# EAGLE design headstage (EAGLE 6.5.0)
HEADSTAGE_TYPE: JMD Dual RHD2132; REVISION: 0.0
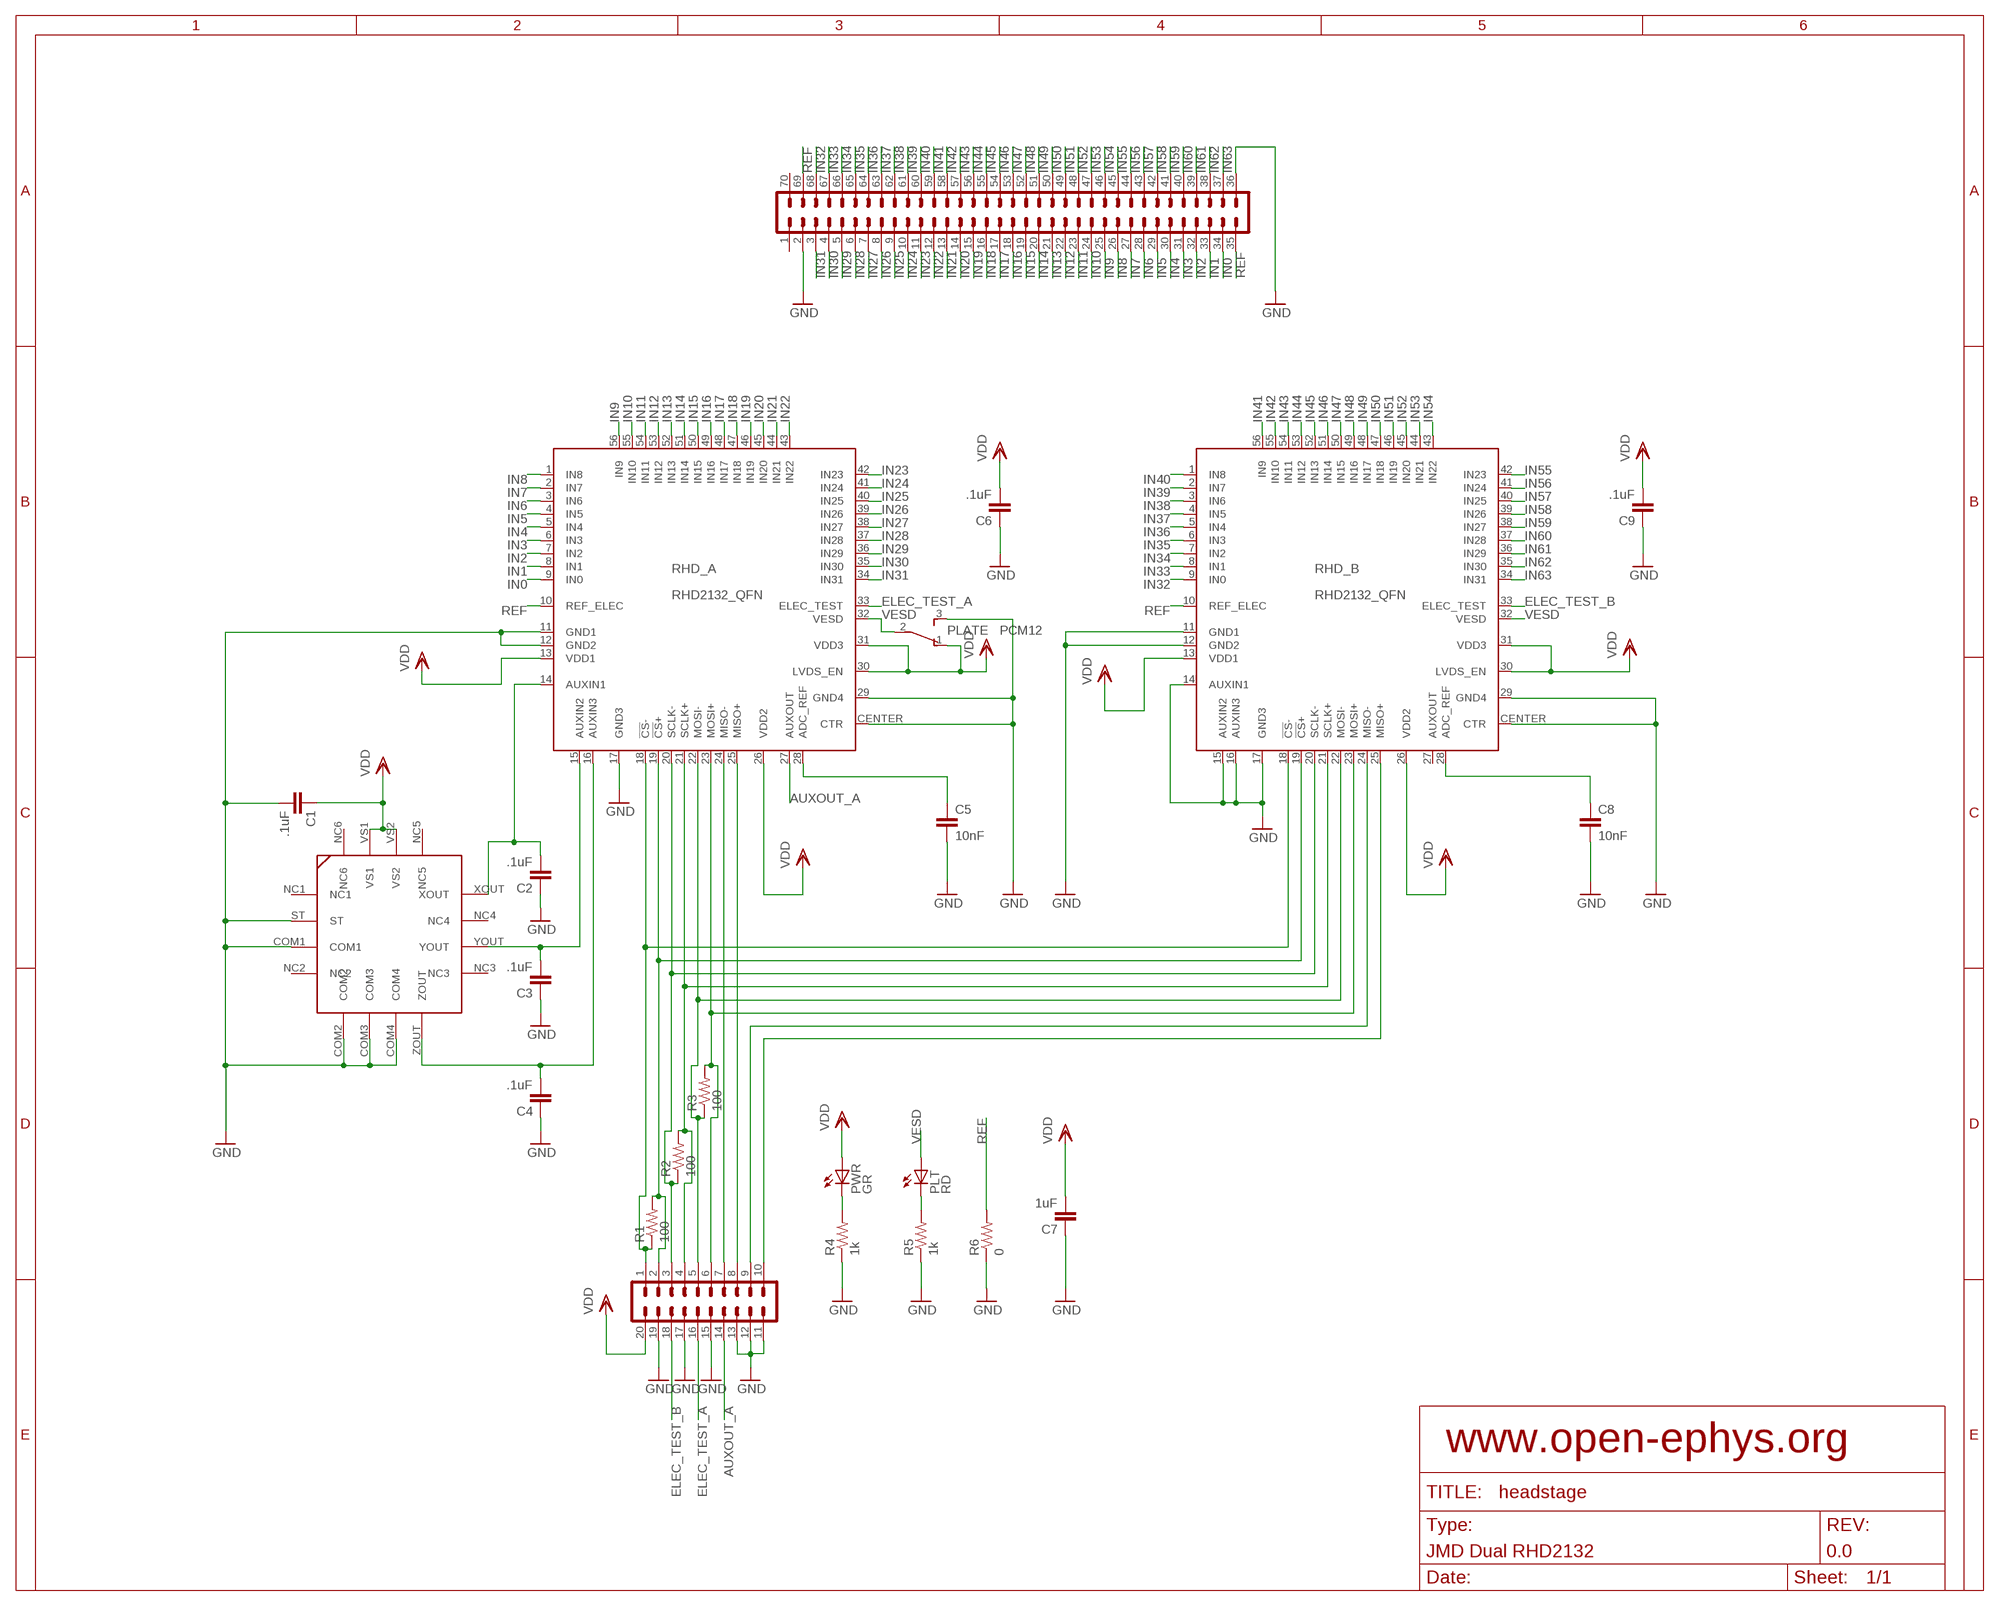
[diagram p0: schematic, sheet 1]

## Parts
AIN  JMD70  PINHD-2X35_JMD70  [JMD70]
C1  .1uF  C_0402  [0402]
C2  .1uF  C_0402  [0402]
C3  .1uF  C_0402  [0402]
C4  .1uF  C_0402  [0402]
C5  10nF  C_0402  [0402]
C6  .1uF  C_0603  [0603]
C7  1uF  C_0603  [0603]
C8  10nF  C_0402  [0402]
C9  .1uF  C_0603  [0603]
OUT  JMD  PINHD-2X10_JMD-RA  [JMD20-RA]
PLATE  PCM12  SPDT_PCM12  [PCM12]
PLT  RD  LED_0603  [CHIP-LED0603]
PWR  GR  LED_0603  [CHIP-LED0603]
R1  100  R_0402  [0402]
R2  100  R_0402  [0402]
R3  100  R_0402  [0402]
R4  1k  R_0402  [0402]
R5  1k  R_0402  [0402]
R6  0  R_0402  [0402]
RHD_A  RHD2132_QFN  [QFN56_8_X_8_LARGE]
RHD_B  RHD2132_QFN  [QFN56_8_X_8_LARGE]
U1  ADXL335  [ADXL335]

## Nets
AUXOUT_A: OUT.14 RHD_A.27(AUXOUT)
CS+: OUT.2 R1.2 RHD_A.19(!CS!+) RHD_B.19(!CS!+)
CS-: OUT.1 R1.1 RHD_A.18(!CS!-) RHD_B.18(!CS!-)
ELEC_TEST_A: OUT.16 RHD_A.33(ELEC_TEST)
ELEC_TEST_B: OUT.18 RHD_B.33(ELEC_TEST)
GND: AIN.2 AIN.36 C1.2 C2.1 C3.1 C4.1 C5.2 C6.1 C7.1 C8.2 C9.1 OUT.11 OUT.12 OUT.13 OUT.15 OUT.17 OUT.19 PLATE.3 R4.1 R5.1 R6.1 RHD_A.11(GND1) RHD_A.12(GND2) RHD_A.17(GND3) RHD_A.29(GND4) RHD_A.CENTER(CTR) RHD_B.11(GND1) RHD_B.12(GND2) RHD_B.14(AUXIN1) RHD_B.15(AUXIN2) RHD_B.16(AUXIN3) RHD_B.17(GND3) RHD_B.29(GND4) RHD_B.CENTER(CTR) U1.COM1 U1.COM2 U1.COM3 U1.COM4 U1.ST
IN0: AIN.34 RHD_A.9(IN0)
IN1: AIN.33 RHD_A.8(IN1)
IN2: AIN.32 RHD_A.7(IN2)
IN3: AIN.31 RHD_A.6(IN3)
IN4: AIN.30 RHD_A.5(IN4)
IN5: AIN.29 RHD_A.4(IN5)
IN6: AIN.28 RHD_A.3(IN6)
IN7: AIN.27 RHD_A.2(IN7)
IN8: AIN.26 RHD_A.1(IN8)
IN9: AIN.25 RHD_A.56(IN9)
IN10: AIN.24 RHD_A.55(IN10)
IN11: AIN.23 RHD_A.54(IN11)
IN12: AIN.22 RHD_A.53(IN12)
IN13: AIN.21 RHD_A.52(IN13)
IN14: AIN.20 RHD_A.51(IN14)
IN15: AIN.19 RHD_A.50(IN15)
IN16: AIN.18 RHD_A.49(IN16)
IN17: AIN.17 RHD_A.48(IN17)
IN18: AIN.16 RHD_A.47(IN18)
IN19: AIN.15 RHD_A.46(IN19)
IN20: AIN.14 RHD_A.45(IN20)
IN21: AIN.13 RHD_A.44(IN21)
IN22: AIN.12 RHD_A.43(IN22)
IN23: AIN.11 RHD_A.42(IN23)
IN24: AIN.10 RHD_A.41(IN24)
IN25: AIN.9 RHD_A.40(IN25)
IN26: AIN.8 RHD_A.39(IN26)
IN27: AIN.7 RHD_A.38(IN27)
IN28: AIN.6 RHD_A.37(IN28)
IN29: AIN.5 RHD_A.36(IN29)
IN30: AIN.4 RHD_A.35(IN30)
IN31: AIN.3 RHD_A.34(IN31)
IN32: AIN.68 RHD_B.9(IN0)
IN33: AIN.67 RHD_B.8(IN1)
IN34: AIN.66 RHD_B.7(IN2)
IN35: AIN.65 RHD_B.6(IN3)
IN36: AIN.64 RHD_B.5(IN4)
IN37: AIN.63 RHD_B.4(IN5)
IN38: AIN.62 RHD_B.3(IN6)
IN39: AIN.61 RHD_B.2(IN7)
IN40: AIN.60 RHD_B.1(IN8)
IN41: AIN.59 RHD_B.56(IN9)
IN42: AIN.58 RHD_B.55(IN10)
IN43: AIN.57 RHD_B.54(IN11)
IN44: AIN.56 RHD_B.53(IN12)
IN45: AIN.55 RHD_B.52(IN13)
IN46: AIN.54 RHD_B.51(IN14)
IN47: AIN.53 RHD_B.50(IN15)
IN48: AIN.52 RHD_B.49(IN16)
IN49: AIN.51 RHD_B.48(IN17)
IN50: AIN.50 RHD_B.47(IN18)
IN51: AIN.49 RHD_B.46(IN19)
IN52: AIN.48 RHD_B.45(IN20)
IN53: AIN.47 RHD_B.44(IN21)
IN54: AIN.46 RHD_B.43(IN22)
IN55: AIN.45 RHD_B.42(IN23)
IN56: AIN.44 RHD_B.41(IN24)
IN57: AIN.43 RHD_B.40(IN25)
IN58: AIN.42 RHD_B.39(IN26)
IN59: AIN.41 RHD_B.38(IN27)
IN60: AIN.40 RHD_B.37(IN28)
IN61: AIN.39 RHD_B.36(IN29)
IN62: AIN.38 RHD_B.35(IN30)
IN63: AIN.37 RHD_B.34(IN31)
LEDOUT1: PWR.C R4.2
LEDOUT2: PLT.C R5.2
MIS02-: OUT.9 RHD_B.24(MISO-)
MISO1+: OUT.8 RHD_A.25(MISO+)
MISO1-: OUT.7 RHD_A.24(MISO-)
MISO2+: OUT.10 RHD_B.25(MISO+)
MOSI+: OUT.6 R3.2 RHD_A.23(MOSI+) RHD_B.23(MOSI+)
MOSI-: OUT.5 R3.1 RHD_A.22(MOSI-) RHD_B.22(MOSI-)
N$3: C8.1 RHD_B.28(ADC_REF)
N$7: C5.1 RHD_A.28(ADC_REF)
REF: AIN.35 AIN.69 R6.2 RHD_A.10(REF_ELEC) RHD_B.10(REF_ELEC)
SCLK+: OUT.4 R2.2 RHD_A.21(SCLK+) RHD_B.21(SCLK+)
SCLK-: OUT.3 R2.1 RHD_A.20(SCLK-) RHD_B.20(SCLK-)
VDD: C1.1 C6.2 C7.2 C9.2 OUT.20 PLATE.1 PWR.A RHD_A.13(VDD1) RHD_A.26(VDD2) RHD_A.30(LVDS_EN) RHD_A.31(VDD3) RHD_B.13(VDD1) RHD_B.26(VDD2) RHD_B.30(LVDS_EN) RHD_B.31(VDD3) U1.VS1 U1.VS2
VESD: PLATE.2 PLT.A RHD_A.32(VESD) RHD_B.32(VESD)
XOUT1: C2.2 RHD_A.14(AUXIN1) U1.XOUT
YOUT1: C3.2 RHD_A.15(AUXIN2) U1.YOUT
ZOUT1: C4.2 RHD_A.16(AUXIN3) U1.ZOUT
Unconnected: AIN.1 AIN.70 RHD_B.27(AUXOUT) U1.NC1 U1.NC2 U1.NC3 U1.NC4 U1.NC5 U1.NC6

## Library data of the parts
AIN = headstage:PINHD-2X35
C1-C9 = headstage:C: Capacitor
OUT = headstage:PINHD-2X10
PLATE = headstage:SPDT: SPDT Switch
PLT PWR = puggleboard:LED
R1-R6 = headstage:R: Resistor
RHD_A RHD_B = headstage:RHD2132
U1 = headstage:ADXL335: The ADXL335 is a small, thin, low power, complete 3-axis accelerometer with signal conditioned voltage outputs. The product measures acceleration with a minimum full-scale range of ±3 g. It can measure the static acceleration of gravity in tilt-sensing applications, as well as dynamic acceleration resulting from motion, shock, or vibration. The user selects the bandwidth of the accelerometer using the CX, CY, and CZ capacitors at the XOUT, YOUT, and ZOUT pins. Bandwidths can be selected to suit the application, with a range of 0.5 Hz to 1600 Hz for the X and Y axes, and a range of 0.5 Hz to 550 Hz for the Z axi

## Board
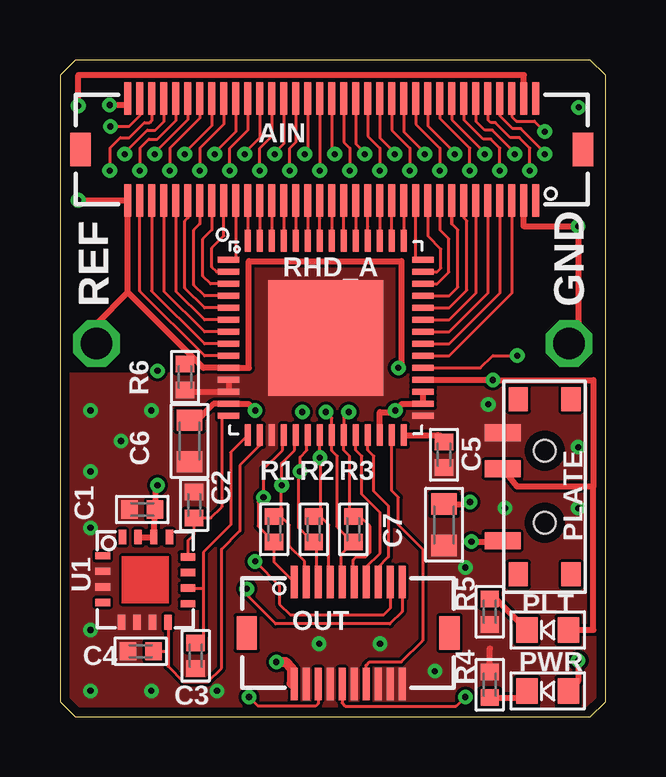
[diagram p1: board, top side]
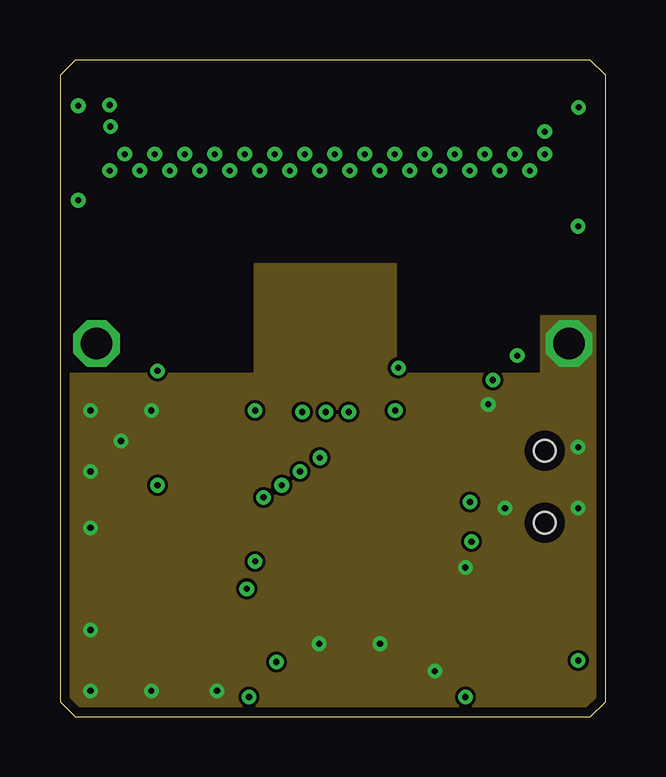
[diagram p2: board, inner layer Route2]
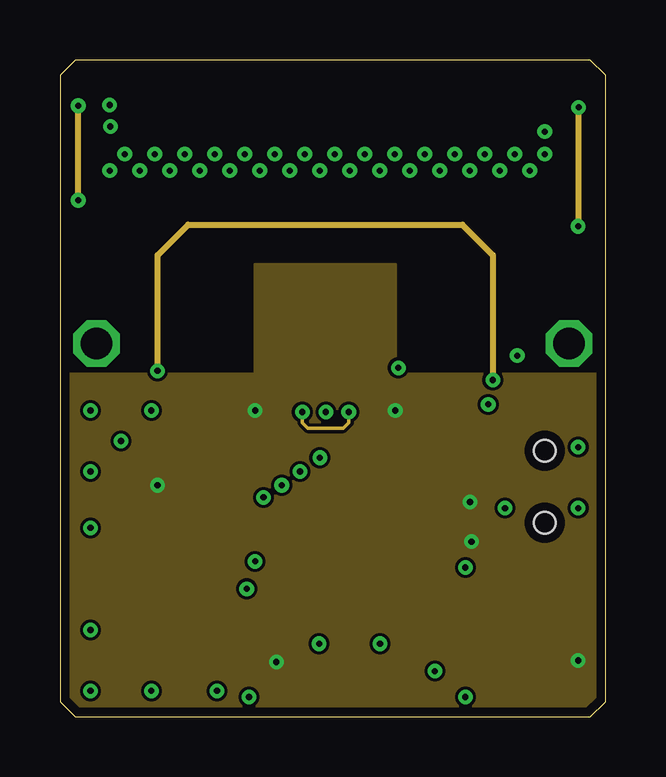
[diagram p3: board, inner layer Route15]
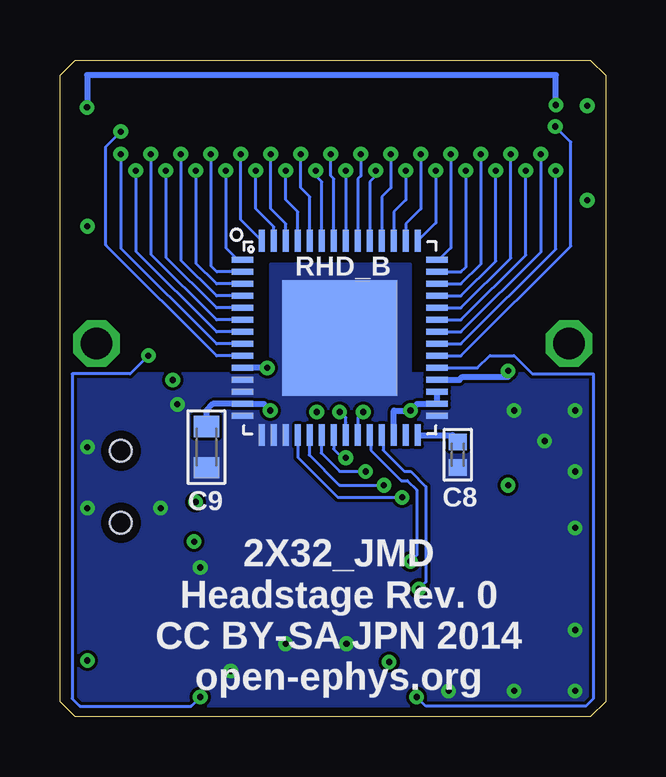
[diagram p4: board, bottom side, seen from below]

Size 22.73 x 27.37 mm. Coordinates in mm from the lower left corner, seen from the top.
Outline: 0.64,0 22.1,0 22.73,0.64 22.73,26.73 22.1,27.37 0.64,27.37 0,26.73 0,0.64 0.64,0
Copper layers (1+2*15+16): Top 0.0356mm / dielectric 1.5011mm / Route2 0.0356mm / dielectric 0.1499mm / Route15 0.0356mm / dielectric 0.2007mm / Bottom 0.0356mm
Design rules "ohs-park-4-layer": minimum track width 5mil, minimum drill 10mil, track to track 5mil, track to pad 5mil, pad to pad 5mil, via to via 5mil, smd to smd 5mil, copper to edge 15mil, drill to drill 5mil, minimum pad ring 7mil, minimum via ring 7mil, stop-mask expansion 4mil, vias tented up to drill 100mil, thermal gap 10mil

### Footprints (pad centres in the part's own frame; a part is rotated, then mirrored left to right if it is on the bottom)
JMD70 = smd 0.3 x 1.35: 1 -8.805,2.125; 2 -8.305,2.125; 3 -7.805,2.125; 4 -7.305,2.125; 5 -6.805,2.125; 6 -6.305,2.125; 7 -5.805,2.125; 8 -5.305,2.125; 9 -4.805,2.125; 10 -4.305,2.125; 11 -3.805,2.125; 12 -3.305,2.125; 13 -2.805,2.125; 14 -2.305,2.125; 15 -1.805,2.125; 16 -1.305,2.125; 17 -0.805,2.125; 18 -0.305,2.125; 19 0.195,2.125; 20 0.695,2.125; 21 1.195,2.125; 22 1.695,2.125; 23 2.195,2.125; 24 2.695,2.125; 25 3.195,2.125; 26 3.695,2.125; 27 4.195,2.125; 28 4.695,2.125; 29 5.195,2.125; 30 5.695,2.125; 31 6.195,2.125; 32 6.695,2.125; 33 7.195,2.125; 34 7.695,2.125; 35 8.195,2.125; 36 8.195,-2.125; 37 7.695,-2.125; 38 7.195,-2.125; 39 6.695,-2.125; 40 6.195,-2.125; 41 5.695,-2.125; 42 5.195,-2.125; 43 4.695,-2.125; 44 4.195,-2.125; 45 3.695,-2.125; 46 3.195,-2.125; 47 2.695,-2.125; 48 2.195,-2.125; 49 1.695,-2.125; 50 1.195,-2.125; 51 0.695,-2.125; 52 0.195,-2.125; 53 -0.305,-2.125; 54 -0.805,-2.125; 55 -1.305,-2.125; 56 -1.805,-2.125; 57 -2.305,-2.125; 58 -2.805,-2.125; 59 -3.305,-2.125; 60 -3.805,-2.125; 61 -4.305,-2.125; 62 -4.805,-2.125; 63 -5.305,-2.125; 64 -5.805,-2.125; 65 -6.305,-2.125; 66 -6.805,-2.125; 67 -7.305,-2.125; 68 -7.805,-2.125; 69 -8.305,-2.125; 70 -8.805,-2.125 | smd 0.85 x 1.4: MECH1 -10.78,0; MECH2 10.17,0
0402 = smd 0.686 x 0.762: 1 -0.533,0; 2 0.533,0
0603 = smd 0.889 x 1.067: 1 -0.864,0; 2 0.864,0
JMD20-RA = smd 0.3 x 1.35: 1 -4.5,2.125; 2 -4,2.125; 3 -3.5,2.125; 4 -3,2.125; 5 -2.5,2.125; 6 -2,2.125; 7 -1.5,2.125; 8 -1,2.125; 9 -0.5,2.125; 10 0,2.125; 11 0,-2.125; 12 -0.5,-2.125; 13 -1,-2.125; 14 -1.5,-2.125; 15 -2,-2.125; 16 -2.5,-2.125; 17 -3,-2.125; 18 -3.5,-2.125; 19 -4,-2.125; 20 -4.5,-2.125 | smd 0.85 x 1.4: MECH1 -6.475,0; MECH2 1.975,0
PCM12 = smd 0.7 x 1.5: 1 -2.25,1.75; 2 0.75,1.75; 3 2.25,1.75 | smd 1 x 0.8: NC1 -3.65,1.1; NC2 -3.65,-1.1; NC3 3.65,-1.1; NC4 3.65,1.1 | hole 0.9: 1.5,0; -1.5,0
CHIP-LED0603 = smd 1.067 x 0.889: A 0,-0.864; C 0,0.864
QFN56_8_X_8_LARGE = smd 0.9 x 0.25: 1 -4.05,3.25; 2 -4.05,2.75; 3 -4.05,2.25; 4 -4.05,1.75; 5 -4.05,1.25; 6 -4.05,0.75; 7 -4.05,0.25; 8 -4.05,-0.25; 9 -4.05,-0.75; 10 -4.05,-1.25; 11 -4.05,-1.75; 12 -4.05,-2.25; 13 -4.05,-2.75; 14 -4.05,-3.25; 29 4.05,-3.25; 30 4.05,-2.75; 31 4.05,-2.25; 32 4.05,-1.75; 33 4.05,-1.25; 34 4.05,-0.75; 35 4.05,-0.25; 36 4.05,0.25; 37 4.05,0.75; 38 4.05,1.25; 39 4.05,1.75; 40 4.05,2.25; 41 4.05,2.75; 42 4.05,3.25 | smd 0.25 x 0.9: 15 -3.25,-4.05; 16 -2.75,-4.05; 17 -2.25,-4.05; 18 -1.75,-4.05; 19 -1.25,-4.05; 20 -0.75,-4.05; 21 -0.25,-4.05; 22 0.25,-4.05; 23 0.75,-4.05; 24 1.25,-4.05; 25 1.75,-4.05; 26 2.25,-4.05; 27 2.75,-4.05; 28 3.25,-4.05; 43 3.25,4.05; 44 2.75,4.05; 45 2.25,4.05; 46 1.75,4.05; 47 1.25,4.05; 48 0.75,4.05; 49 0.25,4.05; 50 -0.25,4.05; 51 -0.75,4.05; 52 -1.25,4.05; 53 -1.75,4.05; 54 -2.25,4.05; 55 -2.75,4.05; 56 -3.25,4.05 | smd 4.8 x 4.8: CENTER 0,0
ADXL335 = smd 0.61 x 0.305: COM1 -1.775,-0.3; NC1 -1.775,1; NC2 -1.775,-0.95; NC3 1.775,-1; NC4 1.775,0.3; ST -1.775,0.35; XOUT 1.775,0.95; YOUT 1.775,-0.35 | smd 0.305 x 0.61: COM2 -1,-1.775; COM3 -0.35,-1.775; COM4 0.3,-1.775; NC5 1,1.775; NC6 -0.95,1.775; VS1 0.35,1.775; VS2 -0.3,1.775; ZOUT 0.95,-1.775

### Placement (x,y rotation side)
AIN  11.02,23.64 180 top
C1  3.43,8.64 180 top
C2  5.59,8.83 270 top
C3  5.65,2.54 90 top
C4  3.37,2.73 0 top
C5  16,10.92 270 top
C6  5.4,11.49 90 top
C7  16,8 90 top
C8  6.16,10.92 270 bottom
C9  16.64,11.24 90 bottom
OUT  14.26,3.49 0 top
PLATE  20.19,9.59 90 top
PLT  20.32,3.62 90 top
PWR  20.32,1.08 90 top
R1  8.92,7.81 90 top
R2  10.57,7.81 90 top
R3  12.22,7.81 90 top
R4  17.91,1.33 270 top
R5  17.91,4.38 90 top
R6  5.21,14.16 90 top
RHD_A  11.07,15.79 0 top
RHD_B  11.07,15.79 0 bottom
U1  3.56,5.71 0 top

### Tracks (layer width: path | path; a pad name or v marks a point on that pad's centre or on a via)
AUXOUT_A
  Top 0.127: RHD_A.27 13.82,9.42 14.1,9.14 14.1,8 15.11,6.99 15.11,3.17 14.22,2.29 12.89,2.29 12.76,2.15 OUT.14
  Top 0.152: RHD_A.27 13.84,11.72
CS+  (via drill 0.25)
  Top 0.127: 10.19,5.55 10.19,6.48 9.56,7.11 9.56,8 9.21,8.34 9.21,9.63 v9.24,9.65 9.24,10.57 9.78,11.11 9.78,11.74
  Top 0.152: OUT.2 10.19,5.55 | 9.21,8.34 R1.2 | 9.78,11.74 RHD_A.19
  Bottom 0.127: 12.36,11.7 12.36,10.91 11.09,9.65 v9.24,9.65
  Bottom 0.152: RHD_B.19 12.36,11.7
CS-  (via drill 0.25)
  Top 0.127: OUT.1 8.92,6.45 R1.1 8.26,7.94 8.26,8.95 8.45,9.14 v8.48,9.14 8.48,10.32 9.27,11.11 9.27,11.74 RHD_A.18
  Bottom 0.127: RHD_B.18 12.82,10.81 11.16,9.14 v8.48,9.14
ELEC_TEST_A  (via drill 0.25)
  Top 0.127: RHD_A.33 17.52,14.54 18.03,15.05 v19.05,15.05 | v16.89,0.83 16.51,0.45 11.89,0.45 11.76,0.58 OUT.16
  Bottom 0.127: v19.05,15.05 19.81,14.29 22.23,14.29 22.23,0.76 21.91,0.45 17.27,0.45 v16.89,0.83
ELEC_TEST_B  (via drill 0.25)
  Top 0.127: v7.87,0.83 8.26,0.45 10.65,0.45 10.76,0.55 OUT.18
  Bottom 0.127: RHD_B.33 5.34,14.54 4.83,15.05 3.81,15.05 3.05,14.29 0.51,14.29 0.51,0.76 0.83,0.45 7.49,0.45 v7.87,0.83
GND  (via drill 0.25, 1.3)
  Top 0.254: AIN.36 2.83,25.49 v2.07,25.49 | AIN.2 19.32,20.44 v21.59,20.44 | v21.59,20.44 21.61,20.44 | 5.05,13.53 R6.1 5.3,13.54 RHD_A.12 RHD_A.11 | v21.59,20.44 21.59,15.94 v21.21,15.56 | R4.1 17.91,2.86
  Route15 0.254: v21.61,25.39 21.59,25.38 v21.59,20.44
  Bottom 0.254: v2.07,25.49 2.07,26.74 21.61,26.74 v21.61,25.39
  other vias: 1.27,10.22 1.27,12.76 1.27,3.62 1.27,7.87 6.54,1.08 3.81,1.08 1.27,1.08 21.59,8.7 21.59,11.24 15.62,1.91 3.81,12.76 18.54,8.7 16.89,6.22 13.34,3.05 10.79,3.05 2.54,11.49 17.84,13.02
  pour Route2 (no thermals): 0,0 0,14.29 8.13,14.29 8.13,18.86 13.97,18.86 13.97,14.29 20.07,14.29 20.07,16.7 22.73,16.7 22.73,0
  pour Top (no thermals): 0,0 0,14.29 8.13,14.29 8.13,18.86 13.97,18.86 13.97,14.29 22.73,14.29 22.73,0
  pour Bottom (no thermals): 0,0 0,14.29 8.13,14.29 8.13,18.86 13.97,18.86 13.97,14.29 22.73,14.29 22.73,0
IN0
  Top 0.127: RHD_A.9 6.03,15.04 3.33,17.74 AIN.34
  Top 0.152: AIN.34
IN1
  Top 0.127: RHD_A.8 6.03,15.54 3.83,17.74 | AIN.33 3.83,17.78 | 3.83,17.78 3.83,17.74 | 3.83,17.74 3.83,17.78 | 3.83,17.78
IN2
  Top 0.127: RHD_A.7 6.03,16.04 4.33,17.74 | AIN.32 4.33,17.74 | 4.33,17.74
IN3
  Top 0.127: RHD_A.6 6.03,16.54 4.83,17.74 | AIN.31 4.83,17.74 | 4.83,17.74
IN4
  Top 0.127: 5.33,20.79 5.2,20.66 5.2,17.86 6.03,17.04 RHD_A.5 | AIN.30 5.33,20.83 | 5.33,20.83 5.33,20.79 | 5.33,20.79 5.33,20.83 | 5.33,20.83
IN5
  Top 0.127: 5.83,20.54 5.58,20.29 5.58,17.99 6.03,17.54 RHD_A.4 | AIN.29 5.83,20.57 | 5.83,20.57 5.83,20.54 | 5.83,20.54 5.83,20.57 | 5.83,20.57
IN6
  Top 0.127: 6.33,20.29 | 6.33,20.29 5.95,19.91 5.95,18.36 6.28,18.04 RHD_A.3 | AIN.28 6.33,20.29
IN7
  Top 0.127: RHD_A.2 6.53,18.54 6.33,18.74 6.33,19.54 6.83,20.04 AIN.27
  Top 0.152: AIN.27
IN8
  Top 0.127: AIN.26 7.33,19.04
  Top 0.152: 7.33,19.04 RHD_A.1 7.33,19.04
IN9
  Top 0.127: AIN.25 RHD_A.56
  Top 0.152: RHD_A.56
IN10
  Top 0.127: AIN.24 RHD_A.55
  Top 0.152: RHD_A.55
IN11
  Top 0.127: AIN.23 RHD_A.54
  Top 0.152: RHD_A.54
IN12
  Top 0.127: AIN.22 RHD_A.53
  Top 0.152: RHD_A.53
IN13
  Top 0.127: AIN.21 RHD_A.52
  Top 0.152: RHD_A.52
IN14
  Top 0.127: AIN.20 RHD_A.51
  Top 0.152: RHD_A.51
IN15
  Top 0.127: RHD_A.50 10.82,20.75 AIN.19
IN16
  Top 0.127: AIN.18 RHD_A.49
  Top 0.152: RHD_A.49
IN17
  Top 0.127: RHD_A.48 AIN.17
  Top 0.152: AIN.17
IN18
  Top 0.127: AIN.16 RHD_A.47
  Top 0.152: RHD_A.47
IN19
  Top 0.127: RHD_A.46 12.82,20.44 AIN.15
IN20
  Top 0.127: AIN.14 RHD_A.45
  Top 0.152: RHD_A.45
IN21
  Top 0.127: RHD_A.44 AIN.13
  Top 0.152: AIN.13
IN22
  Top 0.127: AIN.12 RHD_A.43
  Top 0.152: RHD_A.43
IN23
  Top 0.127: 14.82,19.04 AIN.11
  Top 0.152: 14.82,19.04 RHD_A.42 | AIN.11
IN24
  Top 0.127: RHD_A.41 15.71,18.54 15.87,18.7 15.87,19.49 15.32,20.04 AIN.10
  Top 0.152: AIN.10
IN25
  Top 0.127: RHD_A.40 15.71,18.04 16.2,18.53 16.2,19.91 15.82,20.29 AIN.9
  Top 0.152: AIN.9
IN26
  Top 0.127: 16.32,20.54 16.57,20.29 16.57,17.9 16.21,17.54 RHD_A.39
  Top 0.152: AIN.8 | AIN.8 16.32,20.54
IN27
  Top 0.127: RHD_A.38 16.21,17.04 16.95,17.78 16.95,20.66 16.82,20.79 AIN.7
  Top 0.152: AIN.7
IN28
  Top 0.127: RHD_A.37 16.21,16.54 17.32,17.65 AIN.6
  Top 0.152: AIN.6
IN29
  Top 0.127: RHD_A.36 16.21,16.04 17.82,17.65 AIN.5
  Top 0.152: AIN.5
IN30
  Top 0.127: RHD_A.35 16.21,15.54 18.32,17.65 AIN.4
  Top 0.152: AIN.4
IN31
  Top 0.127: RHD_A.34 16.21,15.04 18.82,17.65 AIN.3
  Top 0.152: AIN.3
IN32  (via drill 0.25)
  Top 0.127: v20.2,24.38 19.76,24.82 19.01,24.82 18.82,25.01 AIN.68
  Bottom 0.127: v20.2,24.38 20.82,23.76 20.82,19.65 16.21,15.04 RHD_B.9
IN33  (via drill 0.25)
  Top 0.127: v20.2,23.45 20.2,23.51 19.2,24.51 18.86,24.51 18.32,25.05 AIN.67
  Bottom 0.127: v20.2,23.45 20.2,19.53 16.21,15.54 RHD_B.8
IN34  (via drill 0.25)
  Top 0.127: v19.57,22.76 19.57,23.7 19.14,24.13 18.76,24.13 18.14,24.76 17.95,24.76 17.82,24.89 AIN.66
  Bottom 0.127: v19.57,22.76 19.57,19.4 16.21,16.04 RHD_B.7
IN35  (via drill 0.25)
  Top 0.127: v18.95,23.45 18.95,23.51 18.01,24.45 17.7,24.45 17.32,24.82 AIN.65
  Bottom 0.127: v18.95,23.45 18.95,19.28 16.21,16.54 RHD_B.6
IN36  (via drill 0.25)
  Top 0.127: v18.32,22.76 18.32,23.7 17.95,24.07 17.64,24.07 16.82,24.89 AIN.64
  Bottom 0.127: v18.32,22.76 18.32,19.15 16.21,17.04 RHD_B.5
IN37  (via drill 0.25)
  Top 0.127: v17.7,23.45 17.7,23.51 16.32,24.89 AIN.63
  Bottom 0.127: v17.7,23.45 17.7,19.03 16.21,17.54 RHD_B.4
IN38  (via drill 0.25)
  Top 0.127: v17.07,22.76 17.07,23.7 15.82,24.95 AIN.62
  Bottom 0.127: v17.07,22.76 17.07,18.9 16.21,18.04 RHD_B.3
IN39  (via drill 0.25)
  Top 0.127: v16.45,23.45 16.45,23.51 15.32,24.64 AIN.61
  Bottom 0.127: v16.45,23.45 16.45,18.79 16.2,18.54 RHD_B.2
IN40  (via drill 0.25)
  Top 0.127: v15.82,22.76 15.82,23.7 14.82,24.7 AIN.60
  Bottom 0.127: v15.82,22.76 15.82,19.54 15.32,19.04 RHD_B.1
IN41  (via drill 0.25)
  Top 0.127: v15.2,23.45 15.2,23.51 14.32,24.39 AIN.59
  Bottom 0.127: RHD_B.56 15.2,20.71 v15.2,23.45
IN42  (via drill 0.25)
  Top 0.127: v14.57,22.76 14.57,23.7 13.82,24.45 AIN.58
  Bottom 0.127: RHD_B.55 13.82,20.41 14.57,21.16 v14.57,22.76
IN43  (via drill 0.25)
  Top 0.127: v13.95,23.45 13.95,23.51 13.32,24.14 AIN.57
  Bottom 0.127: RHD_B.54 13.32,20.54 13.95,21.16 v13.95,23.45
IN44  (via drill 0.25)
  Top 0.127: v13.32,22.76 13.32,23.7 12.82,24.2 AIN.56
  Bottom 0.127: RHD_B.53 12.82,21.04 13.32,21.54 v13.32,22.76
IN45  (via drill 0.25)
  Top 0.127: v12.7,23.45 12.7,23.51 12.32,23.89 AIN.55
  Bottom 0.127: RHD_B.52 12.32,21.66 12.7,22.04 v12.7,23.45
IN46  (via drill 0.25)
  Top 0.127: v12.07,22.76 12.07,23.7 11.82,23.95 AIN.54
  Bottom 0.127: RHD_B.51 11.82,22.29 12.07,22.54 v12.07,22.76
IN47  (via drill 0.25)
  Top 0.127: AIN.53 11.32,23.57 v11.45,23.45
  Bottom 0.127: RHD_B.50 11.32,22.41 11.45,22.54 v11.45,23.45
IN48  (via drill 0.25)
  Top 0.127: AIN.52 v10.82,22.76
  Bottom 0.127: v10.82,22.76 RHD_B.49
IN49  (via drill 0.25)
  Top 0.127: AIN.51 10.32,23.57 v10.2,23.45
  Bottom 0.127: v10.2,23.45 10.2,22.54 10.32,22.41 RHD_B.48
IN50  (via drill 0.25)
  Top 0.127: v9.57,22.76 9.57,23.7 9.82,23.95 AIN.50
  Top 0.152: AIN.50
  Bottom 0.127: v9.57,22.76 9.57,22.54 9.82,22.29 RHD_B.47
IN51  (via drill 0.25)
  Top 0.127: v8.95,23.45 8.95,23.51 9.32,23.88 AIN.49
  Top 0.152: AIN.49
  Bottom 0.127: v8.95,23.45 8.95,22.04 9.32,21.66 RHD_B.46
IN52  (via drill 0.25)
  Top 0.127: v8.32,22.76 8.32,23.7 8.82,24.2 AIN.48
  Top 0.152: AIN.48
  Bottom 0.127: v8.32,22.76 8.32,21.54 8.82,21.04 RHD_B.45
IN53  (via drill 0.25)
  Top 0.127: v7.7,23.45 7.7,23.51 8.32,24.13 AIN.47
  Top 0.152: AIN.47
  Bottom 0.127: v7.7,23.45 7.7,21.16 8.32,20.54 RHD_B.44
IN54  (via drill 0.25)
  Top 0.127: v7.08,22.76 7.08,23.7 7.83,24.45 AIN.46
  Top 0.152: AIN.46
  Bottom 0.127: v7.08,22.76 7.08,20.59 RHD_B.43
IN55  (via drill 0.25)
  Top 0.127: v6.45,23.45 6.45,23.51 7.33,24.38 AIN.45
  Top 0.152: AIN.45
  Bottom 0.127: v6.45,23.45 6.45,19.54 6.95,19.04 RHD_B.42
IN56  (via drill 0.25)
  Top 0.127: v5.83,22.76 5.83,23.7 6.83,24.7 AIN.44
  Top 0.152: AIN.44
  Bottom 0.127: v5.83,22.76 5.83,18.74 6.03,18.54 RHD_B.41
IN57  (via drill 0.25)
  Top 0.127: v5.2,23.45 5.2,23.51 6.33,24.63 AIN.43
  Top 0.152: AIN.43
  Bottom 0.127: v5.2,23.45 5.2,18.86 6.03,18.04 RHD_B.40
IN58  (via drill 0.25)
  Top 0.127: v4.58,22.76 4.58,23.7 5.83,24.95 AIN.42
  Top 0.152: AIN.42
  Bottom 0.127: RHD_B.39 6.03,17.54 4.58,18.99 v4.58,22.76
IN59  (via drill 0.25)
  Top 0.127: v3.95,23.45 3.95,23.51 5.33,24.88 AIN.41
  Top 0.152: AIN.41
  Bottom 0.127: RHD_B.38 6.03,17.04 3.95,19.11 v3.95,23.45
IN60  (via drill 0.25)
  Top 0.127: v3.33,22.76 3.33,23.7 3.7,24.07 4.05,24.07 4.83,24.84 AIN.40
  Top 0.152: AIN.40
  Bottom 0.127: RHD_B.37 6.03,16.54 3.33,19.24 v3.33,22.76
IN61  (via drill 0.25)
  Top 0.127: v2.7,23.45 2.7,23.51 3.64,24.45 3.97,24.45 4.33,24.8 AIN.39
  Top 0.152: AIN.39
  Bottom 0.127: v2.7,23.45 2.7,19.36 6.03,16.04 RHD_B.36
IN62  (via drill 0.25)
  Top 0.127: v2.08,22.76 2.08,23.7 2.51,24.13 2.89,24.13 3.51,24.76 3.74,24.76 3.83,24.85 AIN.38
  Top 0.152: AIN.38
  Bottom 0.127: RHD_B.35 6.03,15.54 2.08,19.49 v2.08,22.76
IN63  (via drill 0.25)
  Top 0.127: AIN.37 3.32,25.04 2.87,24.6 v2.1,24.6
  Top 0.152: AIN.37
  Bottom 0.127: RHD_B.34 6.03,15.04 1.45,19.61 1.45,23.95 v2.1,24.6
LEDOUT1
  Top 0.254: R4.2 19.18,0.8 PWR.C
LEDOUT2
  Top 0.254: R5.2 18.16,4.92 PLT.C
MIS02-  (via drill 0.25)
  Top 0.127: OUT.9 13.76,4.52 13.49,4.25 9.59,4.25 9.14,4.7 9.14,5.46 v8.13,6.48
  Bottom 0.127: 9.78,11.69 9.78,11.11 8.51,9.84 8.26,9.84 7.87,9.46 7.87,6.73 v8.13,6.48
  Bottom 0.152: RHD_B.24 9.78,11.69
MISO1+
  Top 0.127: OUT.8 13.26,6.24 13.68,6.67 13.68,8.79 13.08,9.4 13.08,10.86 12.82,11.11 RHD_A.25
  Top 0.152: RHD_A.25
MISO1-
  Top 0.127: OUT.7 12.76,6.25 13.34,6.83 13.34,8.51 12.57,9.27 12.57,10.86 12.32,11.11 RHD_A.24
  Top 0.152: 12.32,11.73 RHD_A.24
MISO2+  (via drill 0.25)
  Top 0.127: OUT.10 14.26,4.38 13.75,3.87 8.98,3.87 7.78,5.08 v7.78,5.33
  Bottom 0.127: 9.27,11.68 9.27,11.11 8.38,10.22 8.13,10.22 7.49,9.59 7.49,5.62 v7.78,5.33
  Bottom 0.152: RHD_B.25 9.27,11.68
MOSI+  (via drill 0.25)
  Top 0.127: 12.22,5.52 12.22,6.54 12.35,6.67 12.73,6.67 12.92,6.86 12.92,7.94 12.52,8.34 | v12.03,12.7 11.82,12.49 RHD_A.23 11.82,11.1 12.06,10.86 12.06,8.5
  Top 0.152: OUT.6 12.22,5.52 | 12.52,8.34 R3.2 12.06,8.5
  Route15 0.152: v10.1,12.7 10.1,12.26 10.32,12.03 11.81,12.03 12.03,12.26 v12.03,12.7
  Bottom 0.127: v10.1,12.7 10.32,12.47 RHD_B.23
MOSI-  (via drill 0.25)
  Top 0.127: 11.72,5.53 11.72,6.77 R3.1 | 12.19,7.28 11.56,7.91 11.56,10.86 11.32,11.09 RHD_A.22 11.32,12.46 v11.08,12.7 11.3,12.48
  Top 0.152: OUT.5 11.72,5.53 | 12.19,7.28 R3.1
  Bottom 0.127: RHD_B.22 10.83,12.26 10.83,12.48 v11.08,12.7
N$3
  Bottom 0.254: RHD_B.28 6.38,11.74 6.38,11.67 C8.1
N$7
  Top 0.254: RHD_A.28 15.72,11.74 arc-90 C5.1
REF  (via drill 0.25, 1.3)
  Top 0.254: AIN.69 19.32,26.74 0.76,26.74 v0.76,25.46 | 5.52,14.99 5.97,14.54 RHD_A.10 7.87,14.54 7.87,18.99 14.22,18.99 14.22,14.67 v14.1,14.54 | 5.52,14.99 2.83,17.69 | 2.83,17.69 AIN.35 0.89,21.52 v0.76,21.53 | R6.2 5.23,14.69 5.52,14.99 | 2.83,17.69 1.52,16.39 v1.52,15.56
  Route15 0.254: v0.76,21.53 v0.76,25.46
  Bottom 0.254: v14.1,14.54 14.23,14.54 RHD_B.10
SCLK+  (via drill 0.25)
  Top 0.127: 11.21,5.54 11.21,8 10.87,8.34 10.87,10.82 v10.83,10.79 RHD_A.21
  Top 0.152: OUT.4 11.21,5.54 11.21,5.52 | 10.42,8.34 R2.2 10.87,8.34
  Bottom 0.127: 11.34,11.68 11.34,11.16 10.97,10.79 v10.83,10.79
  Bottom 0.152: 11.32,11.73 RHD_B.21 11.3,11.71 11.34,11.68
SCLK-  (via drill 0.25)
  Top 0.127: 10.7,5.55 10.7,7.28 | 10.54,7.28 9.94,7.87 9.94,10.16 v10,10.22 10,10.83 10.29,11.11 10.29,11.74
  Top 0.152: OUT.3 10.7,5.55 | R2.1 10.32,7.3 10.32,7.43 | 10.7,7.28 R2.1 | 10.54,7.28 R2.1 | 10.29,11.74 RHD_A.20
  Bottom 0.127: 11.86,11.7 11.86,11 11.08,10.22 v10,10.22
  Bottom 0.152: RHD_B.20 11.86,11.7
VDD  (via drill 0.25)
  Top 0.152: 9.65,1.4 9.73,1.4 OUT.20
  Top 0.254: RHD_A.26 13.32,12.7 13.9,12.7 v13.97,12.76 14.24,13.04 RHD_B.13 RHD_A.31 15.12,13.53 | v17.14,7.3 18.41,7.3 PLATE.1 | U1.VS2 U1.VS1 C1.1 3.96,9.55 v4.06,9.65 | v8.13,12.76 7.86,13.04 RHD_B.30 6.39,13.04 5.71,12.36 C6.2 | v21.59,2.35 21.59,1.49 PWR.A | C7.2 16.99,8.87 v17.08,8.95
  Top 0.406: v9.02,2.29 9.4,2.29 9.65,2.03 9.65,1.4
  Bottom 0.152: RHD_B.13 14.86,13.04
  Bottom 0.254: C9.2 16.64,12.76 16.36,13.04 RHD_B.13 14.24,13.04 v13.97,12.76 | RHD_B.31 RHD_B.30 7.86,13.04 v8.13,12.76 8.82,12.76 RHD_B.26
  pour Route15 (no thermals): 0,0 0,14.29 8.13,14.29 8.13,18.86 13.97,18.86 13.97,14.29 22.73,14.29 22.73,0
VESD  (via drill 0.25)
  Top 0.152: v18.03,14.03 v18.03,14.04 v18.03,14.03
  Top 0.254: RHD_A.32 v18.03,14.04 | v18.03,14.03 22.23,14.03 22.23,9.59 | 22.23,9.59 19.05,9.59 PLATE.2 | PLT.A 22.23,3.62 22.23,9.59
  Route15 0.254: v4.06,14.41 4.06,19.24 5.33,20.51 16.76,20.51 18.03,19.24 v18.03,14.03
  Bottom 0.254: RHD_B.32 6.09,14.04 5.97,14.16 4.06,14.16 v4.06,14.41
XOUT1
  Top 0.127: 6.73,12.51 6.73,8.74 6.29,8.29 C2.2 5.59,7.59 5.33,7.34 U1.XOUT
  Top 0.152: RHD_A.14 6.76,12.54 6.73,12.51
YOUT1
  Top 0.127: RHD_A.15 7.11,11.02 7.11,8 5.97,6.86 5.97,5.37 | 5.97,5.37 5.97,3.39 C3.2 | U1.YOUT 5.97,5.37
ZOUT1
  Top 0.127: RHD_A.16 8.32,11.31 7.49,10.48 7.49,7.75 6.73,6.99 6.73,2.03 6.16,1.46 5.14,1.46 4.51,2.1 4.51,2.73 | U1.ZOUT 4.51,2.73 | C4.2 4.51,2.73

### Text on the board
tPlace: REF | GND
bPlace: 2X32_JMD / Headstage Rev. 0 / CC BY-SA JPN 2014 / open-ephys.org